# EAGLE schematic hakko_t12 (EAGLE 9.6.1)
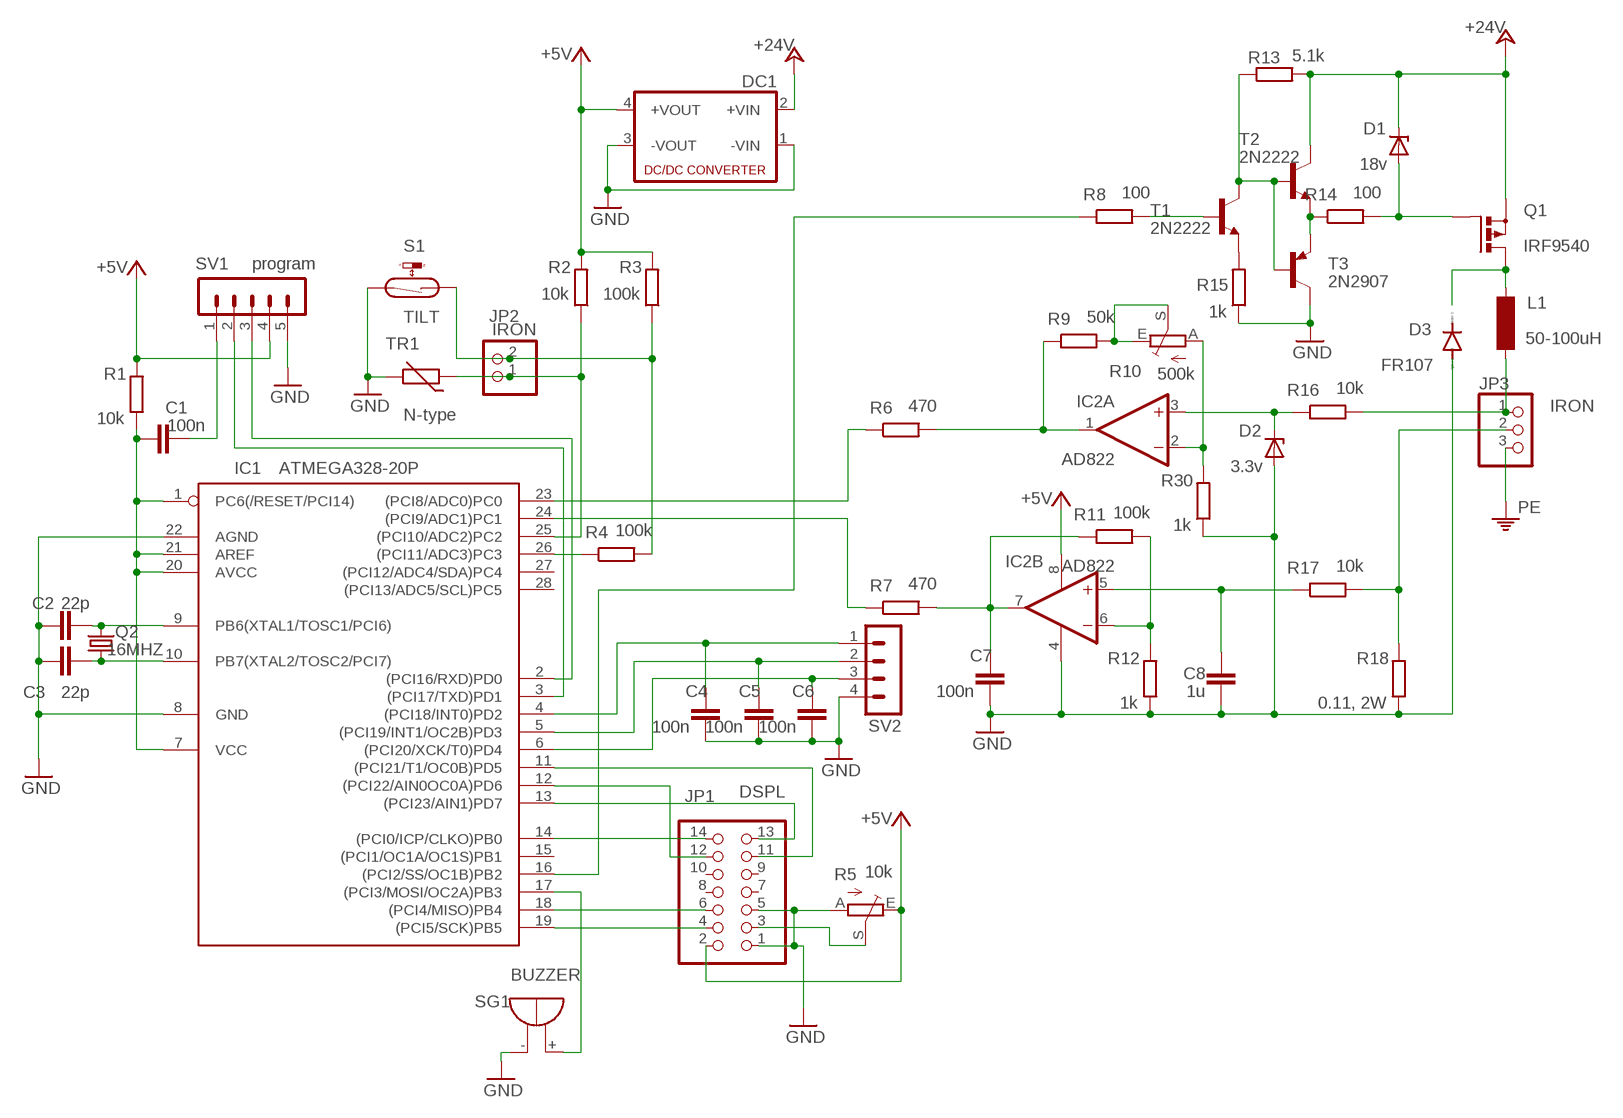
[diagram p0: schematic, sheet 1]

## Parts
C1  100n  C-EUC0805  [C0805]
C2  22p  C-EUC0805  [C0805]
C3  22p  C-EUC0805  [C0805]
C4  100n  C-EUC0805  [C0805]
C5  100n  C-EUC0805  [C0805]
C6  100n  C-EUC0805  [C0805]
C7  100n  C-EUC0805  [C0805]
C8  1u  C-EUC0805  [C0805]
D1  18v  ZENER-DIODEC1702-15  [C1702-15]
D2  3.3v  ZENER-DIODEC1702-15  [C1702-15]
D3  FR107  1N4004  [DO41-10]
DC1  NME  [NME]
IC1  ATMEGA328-20P  [DIL28-3]
IC2  AD822  MCP602P  [DIL08]
JP1  DSPL  PINHD-2X7  [2X07]
JP2  IRON  PINHD-1X2  [1X02]
JP3  IRON  PINHD-1X3  [1X03]
L1  50-100uH  SD8  [SD8]
Q1  IRF9540  PMOSFET_PTO220BH  [TO220BH]
Q2  16MHZ  CRYSTALHC49S  [HC49/S]
R1  10k  R-EU_R0805  [R0805]
R2  10k  R-EU_R0805  [R0805]
R3  100k  R-EU_R0805  [R0805]
R4  100k  R-EU_R0805  [R0805]
R5  10k  TRIM_EU-B25P  [B25P]
R6  470  R-EU_R0805  [R0805]
R7  470  R-EU_R0805  [R0805]
R8  100  R-EU_R0805  [R0805]
R9  50k  R-EU_R0805  [R0805]
R10  500k  TRIM_EU-RJ9W  [RJ9W]
R11  100k  R-EU_R0805  [R0805]
R12  1k  R-EU_R0805  [R0805]
R13  5.1k  R-EU_R0805  [R0805]
R14  100  R-EU_R0805  [R0805]
R15  1k  R-EU_R0805  [R0805]
R16  10k  R-EU_R0805  [R0805]
R17  10k  R-EU_R0805  [R0805]
R18  0.11, 2W  R-EU_R0805  [R0805]
R30  1k  R-EU_R0805  [R0805]
S1  TILT  REED-SWITCH-CT10-A2  [CT10-A2]
SG1  BUZZER  EB2209A  [EB2209A]
SV1  program  MA05-1  [MA05-1]
SV2  MA04-1  [MA04-1]
T1  2N2222  [TO18]
T2  2N2222  [TO18]
T3  2N2907  2N2907-PNP-TO18-EBC  [TO18]
TR1  N-type  THERMISTOR_R-5  [R-5]

## Nets
+5V: DC1.4(+VOUT) IC2.8(P:V+) JP1.2 R1.2 R2.2 R3.2 R5.E SV1.4
+24V: D1.C DC1.2(+VIN) Q1.S R13.2 T2.3(C)
GND: C2.1 C3.1 C4.2 C5.2 C6.2 C7.2 C8.2 D2.A D3.A DC1.1(-VIN) DC1.3(-VOUT) IC1.8(GND) IC1.22(AGND) IC2.4(P:V-) JP1.1 JP1.5 R5.A R12.1 R15.1 R18.1 R30.1 S1.2 SG1.- SV1.5 SV2.4 T3.3(C) TR1.2
N$1: C2.2 IC1.9(PB6(XTAL1/TOSC1/PCI6)) Q2.2
N$2: C3.2 IC1.10(PB7(XTAL2/TOSC2/PCI7)) Q2.1
N$3: C4.1 IC1.4((PCI18/INT0)PD2) SV2.1
N$4: C1.2 SV1.1
N$5: C5.1 IC1.5((PCI19/INT1/OC2B)PD3) SV2.2
N$6: C1.1 IC1.1(PC6(/RESET/PCI14)) IC1.7(VCC) IC1.20(AVCC) IC1.21(AREF) R1.1
N$7: IC1.3((PCI17/TXD)PD1) SV1.2
N$8: IC1.2((PCI16/RXD)PD0) SV1.3
N$9: C6.1 IC1.6((PCI20/XCK/T0)PD4) SV2.3
N$10: IC1.11((PCI21/T1/OC0B)PD5) JP1.11
N$11: IC1.13((PCI23/AIN1)PD7) JP1.13
N$12: IC1.19((PCI5/SCK)PB5) JP1.4
N$13: IC1.14((PCI0/ICP/CLKO)PB0) JP1.14
N$14: IC1.12((PCI22/AIN0OC0A)PD6) JP1.12
N$15: JP1.3 R5.S
N$16: IC1.18((PCI4/MISO)PB4) JP1.6
N$17: IC1.17((PCI3/MOSI/OC2A)PB3) SG1.+
N$18: C7.1 IC2.7(B:OUT) R7.2 R11.1
N$19: IC1.24((PCI9/ADC1)PC1) R7.1
N$20: IC2.6(B:-IN) R11.2 R12.2
N$21: IC1.25((PCI10/ADC2)PC2) JP2.1 R2.1 TR1.1
N$22: IC1.26((PCI11/ADC3)PC3) R4.1
N$23: C8.1 IC2.5(B:+IN) R17.1
N$24: JP2.2 R3.1 R4.2 S1.1
N$25: R9.2 R10.E R10.S
N$26: IC2.2(A:-IN) R10.A R30.2
N$27: IC2.1(A:OUT) R6.2 R9.1
N$28: D2.C IC2.3(A:+IN) R16.1
N$29: IC1.23((PCI8/ADC0)PC0) R6.1
N$31: JP3.1 L1.1 R16.2
N$32: L1.2 Q1.D
N$33: D1.A Q1.G R14.2
N$34: R14.1 T2.1(E) T3.1(E)
N$35: R13.1 T1.3(C) T2.2(B) T3.2(B)
N$36: R15.2 T1.1(E)
N$38: R8.2 T1.2(B)
N$39: IC1.16((PCI2/SS/OC1B)PB2) R8.1
N$40: JP3.2 R17.2 R18.2
PE: JP3.3
Unconnected: D3.C IC1.15((PCI1/OC1A/OC1S)PB1) IC1.27((PCI12/ADC4/SDA)PC4) IC1.28((PCI13/ADC5/SCL)PC5) JP1.7 JP1.8 JP1.9 JP1.10

## Library data of the parts
C1-C8 = rcl:C-EU: CAPACITOR, European symbol; SPICEPREFIX: C
D1 D2 = _mod_diode:ZENER-DIODE: Z-Diode
D3 = diode:1N4004: DIODE general purpose rectifier, 1 A
DC1 = dc-dc-converter:NME: DC-DC CONVERTER; MF: C & D TECHNOLOGIES, INC; MPN: NME1205D; OC_FARNELL: 1021466; OC_NEWARK: 98B8198
IC1 = atmega328:ATMEGA328*P: MICROCONTROLLER 32 kBytes FLASH 2 kBytes SRAM 1 kBytes EEPROM USART 8-channel 10 bit ADC
IC2 = linear:MCP602: Single Op Amp 2.7V to 6.0V Single Supply CMOS Source: http://ww1.microchip.com/downloads/en/DeviceDoc/21314g.pdf
JP1 = pinhead:PINHD-2X7: PIN HEADER
JP2 = pinhead:PINHD-1X2: PIN HEADER
JP3 = pinhead:PINHD-1X3: PIN HEADER
L1 = inductor-neosid:SD8: INDUCTOR nominal inductance; OC_FARNELL: unknown; OC_NEWARK: unknown
Q1 = transistor-power:PMOSFET_P: Power MOSFET P-Channel
Q2 = crystal:CRYSTAL: CRYSTAL; OC_FARNELL: 1667008; OC_NEWARK: unknown
R1-R4 R6-R9 R11-R18 R30 = rcl:R-EU_: RESISTOR, European symbol; SPICEPREFIX: R
R5 R10 = pot:TRIM_EU-: POTENTIOMETER
S1 = switch-reed:REED-SWITCH-: Reed Sensor; OC_FARNELL: unknown
SG1 = buzzer:EB2209A: BUZZER Source: Buerklin; OC_FARNELL: unknown; OC_NEWARK: unknown
SV1 = con-lstb:MA05-1: PIN HEADER; OC_FARNELL: unknown; OC_NEWARK: unknown
SV2 = con-lstb:MA04-1: PIN HEADER; OC_FARNELL: unknown; OC_NEWARK: unknown
T1 T2 = transistor:2N2222: NPN TRANSISTOR
T3 = transistor:*-PNP-: PNP Transistror
TR1 = discrete:THERMISTOR_: Thermo Resistor